# EAGLE schematic 5vBuckV1 (EAGLE 7.6.0)
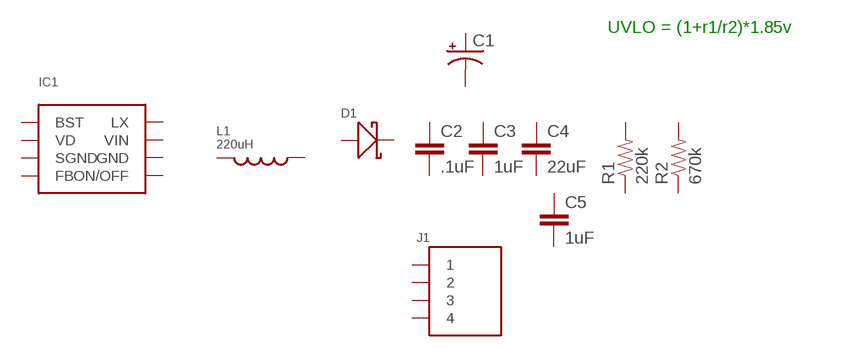
[diagram p0: schematic, sheet 1]

## Parts
C1  CAP_POLF80  [NIPPON_F80]
C2  .1uF  0.33UF-50V-10%(0805)  [0805-CAP]
C3  1uF  0.33UF-50V-10%(0805)  [0805-CAP]
C4  22uF  0.33UF-50V-10%(0805)  [0805-CAP]
C5  1uF  0.33UF-50V-10%(0805)  [0805-CAP]
D1  DIODE_SCHOTTKYSOD-123  [SOD-123]
IC1  M5033  [SOIC-8]
J1  CONNECTOR_4PIN  [4PIN_.1']
L1  220uH  CHIP_IND1  [6X6MM_IND]
R1  220k  0.22OHM-1/4W-1%(0805)  [0805]
R2  670k  0.22OHM-1/4W-1%(0805)  [0805]
Unconnected: C1.+ C1.- C2.1 C2.2 C3.1 C3.2 C4.1 C4.2 C5.1 C5.2 D1.ANODE D1.CATHODE IC1.P$1(BST) IC1.P$2(VD) IC1.P$3(SGND) IC1.P$4(FB) IC1.P$5(ON/OFF) IC1.P$6(GND) IC1.P$7(VIN) IC1.P$8(LX) J1.P$1 J1.P$2 J1.P$3 J1.P$4 L1.P$1 L1.P$2 R1.1 R1.2 R2.1 R2.2

## Notes on the sheet
- UVLO = (1+r1/r2)*1.85v

## Library data of the parts
C1 = SparkFun-Capacitors:CAP_POL: Capacitor Polarized These are standard SMD and PTH capacitors. Normally 10uF, 47uF, and 100uF in electrolytic and tantalum varieties. Always verify the external diameter of the through hole cap, it varies with capacity, voltage, and manufacturer. The EIA devices should be standard.
C2-C5 = SparkFun-Capacitors:0.33UF-50V-10%(0805): CAP-08469; PROD_ID: CAP-08469; VALUE: 0.33uF
D1 = lolomolo:DIODE_SCHOTTKY
IC1 = lolomolo:M5033
J1 = lolomolo:CONNECTOR_4PIN
L1 = lolomolo:CHIP_IND: Chip Inductor
R1 R2 = SparkFun-Resistors:0.22OHM-1/4W-1%(0805): RES-09883; PROD_ID: RES-09883; VALUE: 0.22